# Altium schematic sheet Snippet_HCNR201_Linearity Analog Optocouplers.SchDoc
size 1188 x 840 mm
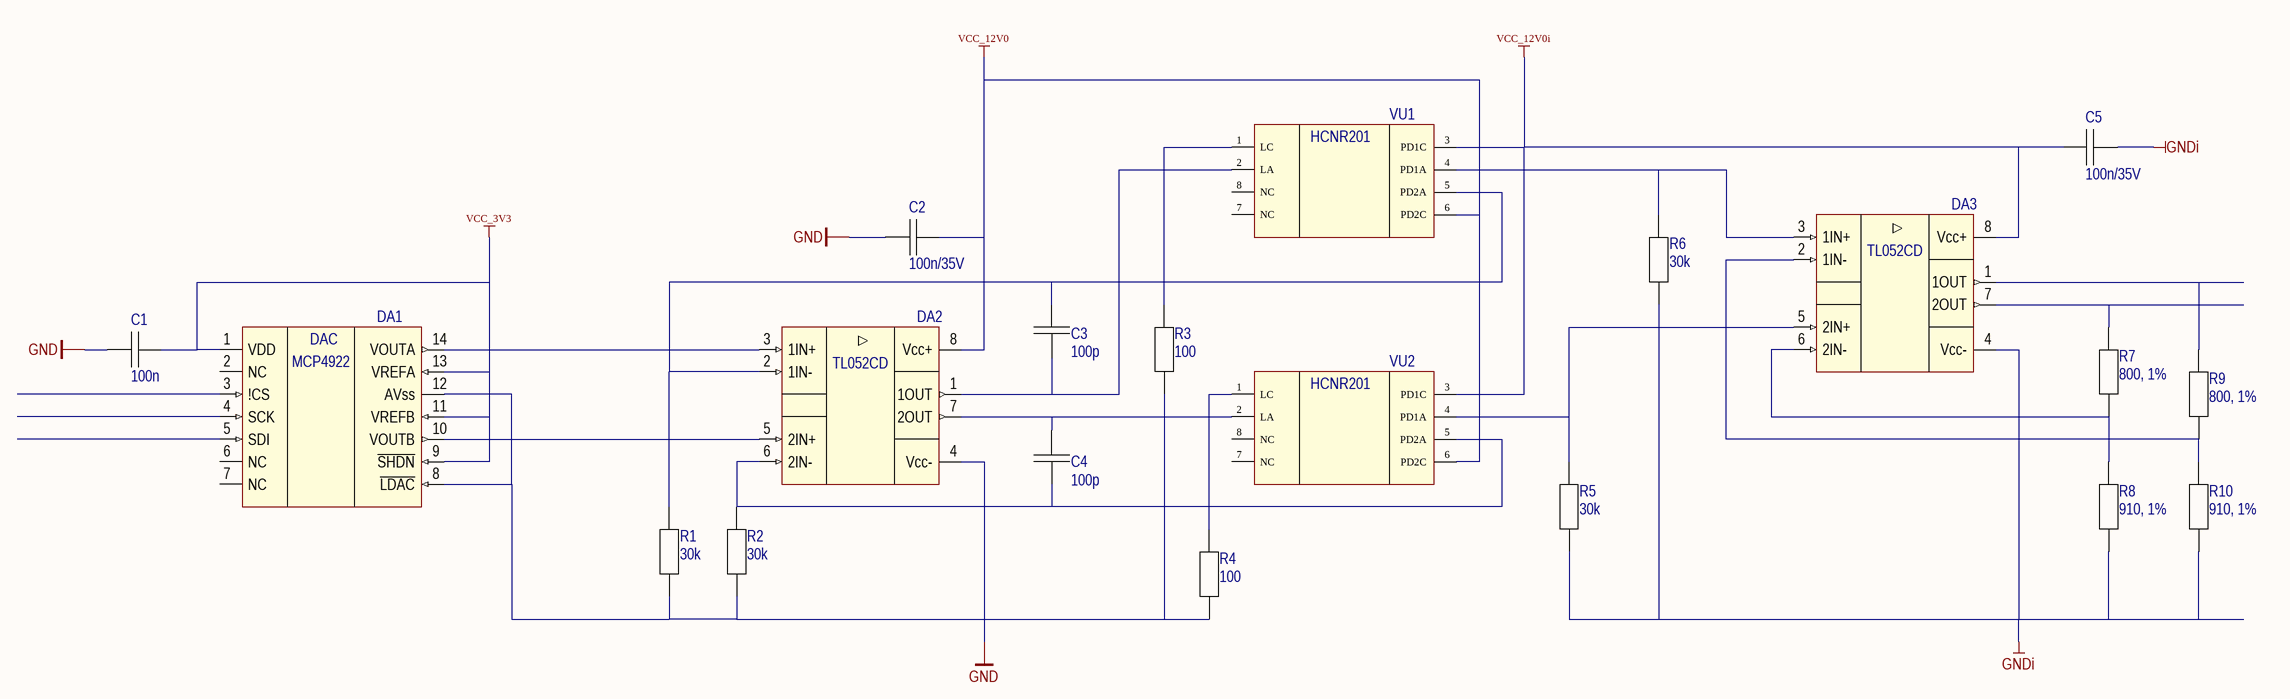
[diagram p0: Snippet_HCNR201_Linearity Analog Optocouplers.SchDoc]

## Parts
C1  100n  [Capacitor_0805]
C2  100n/35V  [Capacitor_0805]
C3  100p  [Capacitor_0805]
C4  100p  [Capacitor_0805]
C5  100n/35V  [Capacitor_0805]
DA1  MCP4922  [MCP4922_SOIC14]
DA2  TL052CD  [AD823_SOIC8]  (value not drawn)
DA3  TL052CD  [AD823_SOIC8]  (value not drawn)
R1  30k  [RESISTOR_SMD0805]
R2  30k  [RESISTOR_SMD0805]
R3  100  [RESISTOR_SMD0805]
R4  100  [RESISTOR_SMD0805]
R5  30k  [RESISTOR_SMD0805]
R6  30k  [RESISTOR_SMD0805]
R7  800, 1%  [RESISTOR_SMD0805]
R8  910, 1%  [RESISTOR_SMD0805]
R9  800, 1%  [RESISTOR_SMD0805]
R10  910, 1%  [RESISTOR_SMD0805]
VU1  HCNR201  [DIP-8 Widebody]  (value not drawn)
VU2  HCNR201  [DIP-8 Widebody]  (value not drawn)

## Nets
GND: C1.1 C2.1 DA1.8(~{LDAC}) DA1.12(AVss) DA2.4(Vcc-) R1.2 R2.2 R3.1 R4.1
GNDi: C5.1 DA3.4(Vcc-) R5.1 R6.1 R8.2 R10.2
VCC_3V3: C1.2 DA1.1(VDD) DA1.9(~{SHDN}) DA1.11(VREFB) DA1.13(VREFA)
VCC_12V0: C2.2 DA2.8(Vcc+) VU1.6(PD2C) VU2.6(PD2C)
VCC_12V0i: C5.2 DA3.8(Vcc+) VU1.3(PD1C) VU2.3(PD1C)
NetC3_1: C3.1 DA2.1(1OUT) VU1.2(LA)
NetC3_2: C3.2 DA2.2(1IN-) R1.1 VU1.5(PD2A)
NetC4_1: C4.1 DA2.7(2OUT) VU2.2(LA)
NetC4_2: C4.2 DA2.6(2IN-) R2.1 VU2.5(PD2A)
NetDA1_10: DA1.10(VOUTB) DA2.5(2IN+)
NetDA1_14: DA1.14(VOUTA) DA2.3(1IN+)
NetDA3_1: DA3.1(1OUT) R9.2
NetDA3_2: DA3.2(1IN-) R9.1 R10.1
NetDA3_3: DA3.3(1IN+) R6.2 VU1.4(PD1A)
NetDA3_5: DA3.5(2IN+) R5.2 VU2.4(PD1A)
NetDA3_6: DA3.6(2IN-) R7.2 R8.1
NetDA3_7: DA3.7(2OUT) R7.1
NetR3_2: R3.2 VU1.1(LC)
NetR4_2: R4.2 VU2.1(LC)

Not connected (* = marked no-connect by the designer): DA1 2(NC) 3(!CS) 4(SCK) 5(SDI) 6(NC) 7(NC); VU1 7(NC) 8(NC); VU2 7(NC) 8(NC)

## Notes on the sheet
- (in symbol MCP4922) DAC

## Library data of the parts
C1 C3 C4 = Capacitor_0805
C2 C5 = Capacitor
DA1 = MCP4922: MCP4922-E/SL
R1-R10 = Resistor_0805